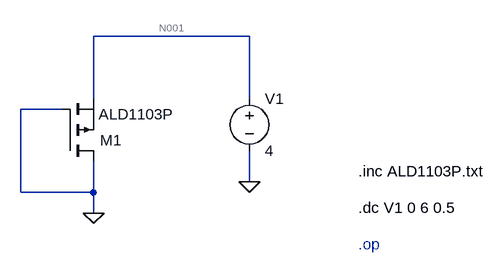
[diagram p0: schematic Prelab.asc]
Prelab.asc, the LTspice schematic file:
Version 4.1
SHEET 1 880 680
WIRE 400 -256 160 -256
WIRE 160 -160 160 -256
WIRE 400 -160 400 -256
WIRE 112 -144 48 -144
WIRE 400 -32 400 -80
WIRE 48 -16 48 -144
WIRE 160 -16 160 -64
WIRE 160 -16 48 -16
WIRE 160 16 160 -16
FLAG 160 16 0
FLAG 400 -32 0
SYMBOL pmos 112 -64 M180
WINDOW 0 92 32 Right 2
SYMATTR InstName M1
SYMATTR Value ALD1103P
SYMBOL voltage 400 -176 R0
SYMATTR InstName V1
SYMATTR Value 4
TEXT 568 -48 Left 2 !.inc ALD1103P.txt
TEXT 568 64 Left 2 ;.op
TEXT 568 8 Left 2 !.dc V1 0 6 0.5

The netlist it stands for:
* Prelab.asc
M1 0 0 N001 N001 ALD1103P
V1 N001 0 4
.model NMOS NMOS
.model PMOS PMOS
.lib standard.mos
.inc ALD1103P.txt
* .op
.dc V1 0 6 0.5
.backanno
.end

* Results of the author's LTspice run, read from the files saved beside the schematic
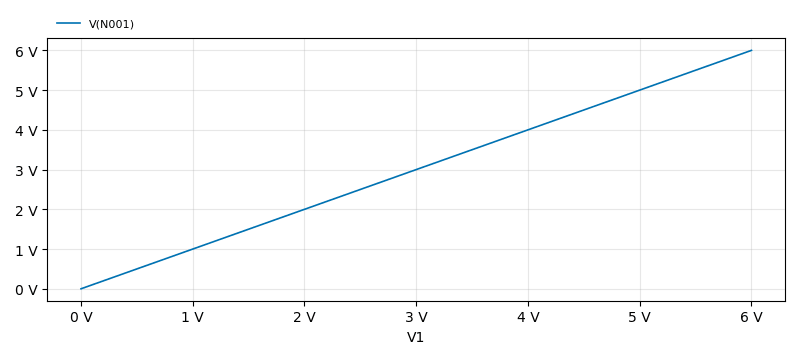
[diagram p1: DC transfer characteristic of Prelab.asc, plotted from the saved traces]
* DC transfer characteristic, 1 run:
*   V(N001): 0 V at V1=0 V, 6 V at V1=6 V, min 0 V, max 6 V